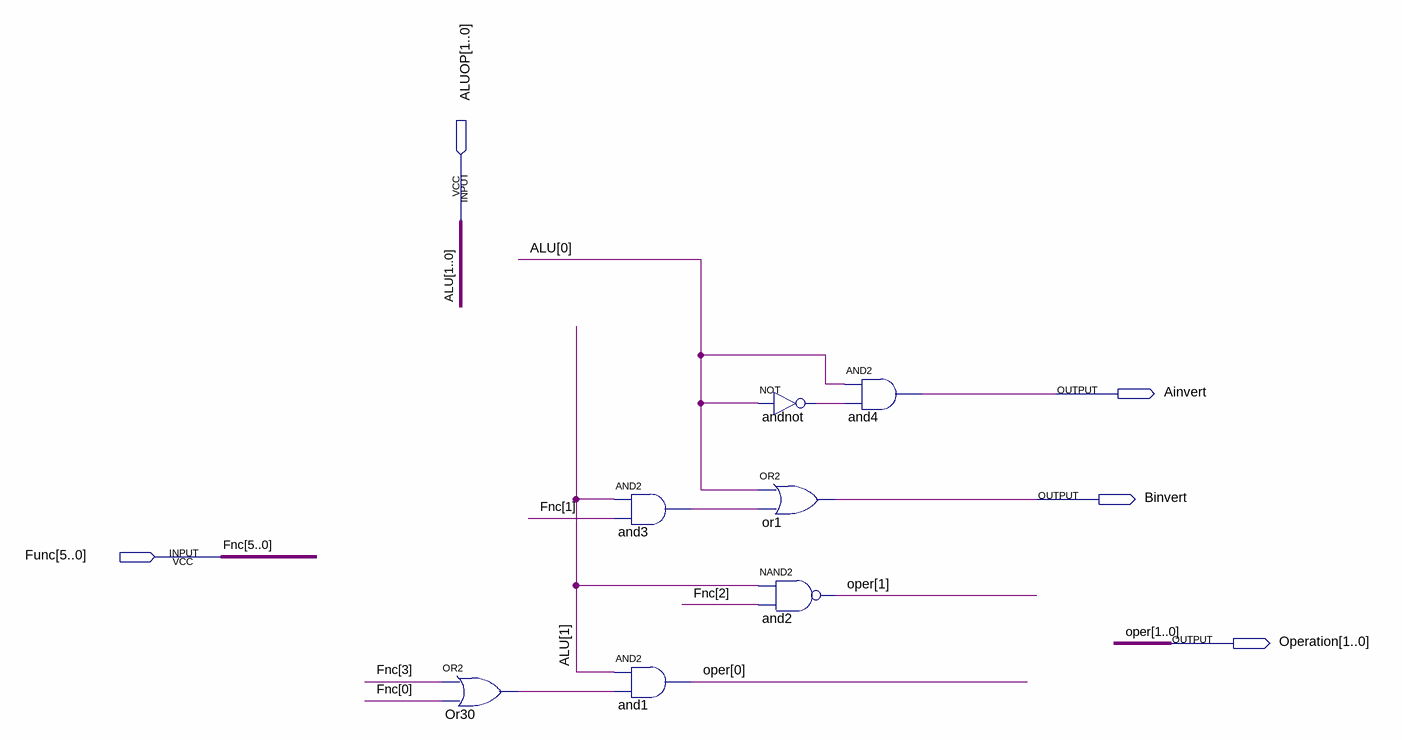
[diagram p0: schematic sheet]
// Quartus schematic ALUControl.bdf as structural Verilog: 7 symbols, 5 pins
module ALUControl (
  input  [1:0] ALUOP,
  input  [5:0] Func,
  output Ainvert,
  output Binvert,
  output [1:0] Operation
);

  wire and3_out, andnot_out, Or30_out;

  or Or30 (Or30_out, Func[3], Func[0]);
  and and3 (and3_out, ALUOP[1], Func[1]);
  and and1 (Operation[0], ALUOP[1], Or30_out);
  not andnot (andnot_out, ALUOP[0]);
  or or1 (Binvert, ALUOP[0], and3_out);
  nand and2 (Operation[1], ALUOP[1], Func[2]);
  and and4 (Ainvert, ALUOP[0], andnot_out);

  // Other names for the same wires on the sheet: ALU[1:0] = ALUOP; Fnc[5:0] = Func; oper[1:0] = Operation
endmodule
